# EAGLE schematic schematic, v.2 (EAGLE 9.2.0)
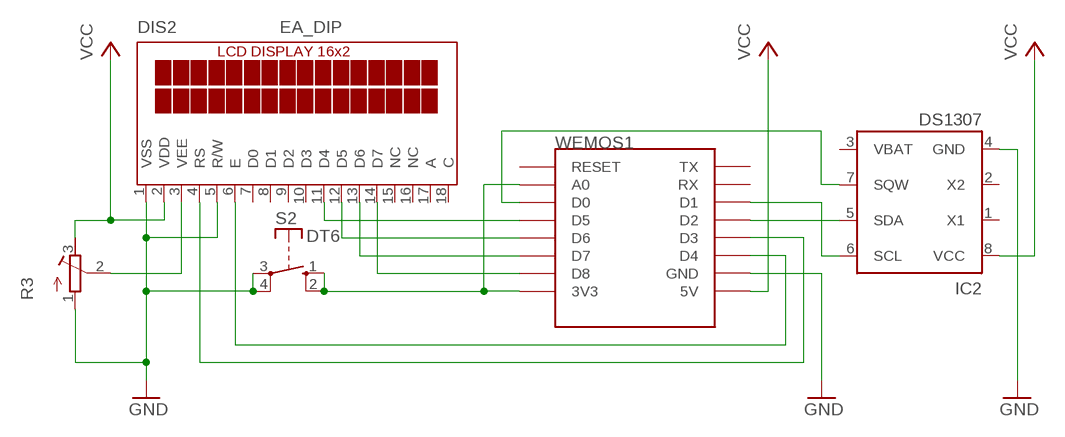
[diagram p0: schematic, sheet 1]

## Parts
DIS2  EA_DIP  [EA_DIP]
IC2  DS1307  [DIL08]
R3  R-TRIMMTS63Y  [RTRIMTS63Y]
S2  DT6  [DT6]
WEMOS1  WEMOS-D1-MINI  [WEMOS-D1-MINI]

## Nets
GND: DIS2.1(VSS) DIS2.5(R/W) IC2.4(GND) R3.1(A) S2.3(P) S2.4(P) WEMOS1.GND
N$1: DIS2.11(D4) WEMOS1.D5
N$3: DIS2.12(D5) WEMOS1.D6
N$5: DIS2.13(D6) WEMOS1.D7
N$11: DIS2.14(D7) WEMOS1.D8
N$12: IC2.5(SDA) WEMOS1.D2
N$17: IC2.6(SCL) WEMOS1.D1
N$18: DIS2.6(E) WEMOS1.D4
N$19: DIS2.4(RS) WEMOS1.D3
N$20: IC2.7(SQW) WEMOS1.D0
N$21: DIS2.3(VEE) R3.2(S)
N$22: S2.1(S) S2.2(S) WEMOS1.3V3 WEMOS1.A0
VCC: DIS2.2(VDD) IC2.8(VCC) R3.3(E) WEMOS1.5V
Unconnected: DIS2.7(D0) DIS2.8(D1) DIS2.9(D2) DIS2.10(D3) DIS2.15(NC) DIS2.16(NC) DIS2.17(A) DIS2.18(C) IC2.1(X1) IC2.2(X2) IC2.3(VBAT) WEMOS1.RESET WEMOS1.RX WEMOS1.TX

## Library data of the parts
DIS2 = display-lcd:EA_DIP: LCD-MODUL 2x16 - 6,68mm, INKL. KONTROLLER HD44780 Source: Data sheet <http://www.lcd-module.de/pdf/doma/dip162-d.pdf>
IC2 = ds1307_pcf8583:DS1307: I2C-Bus CLOCK/CALENDAR
R3 = rcl:R-TRIMM: Trimm resistor
S2 = switch-misc:DT: ITT SWITCH
WEMOS1 = esp8266modules:WEMOS-D1-MINI: WeMos.cc D1 mini ESP8266 module